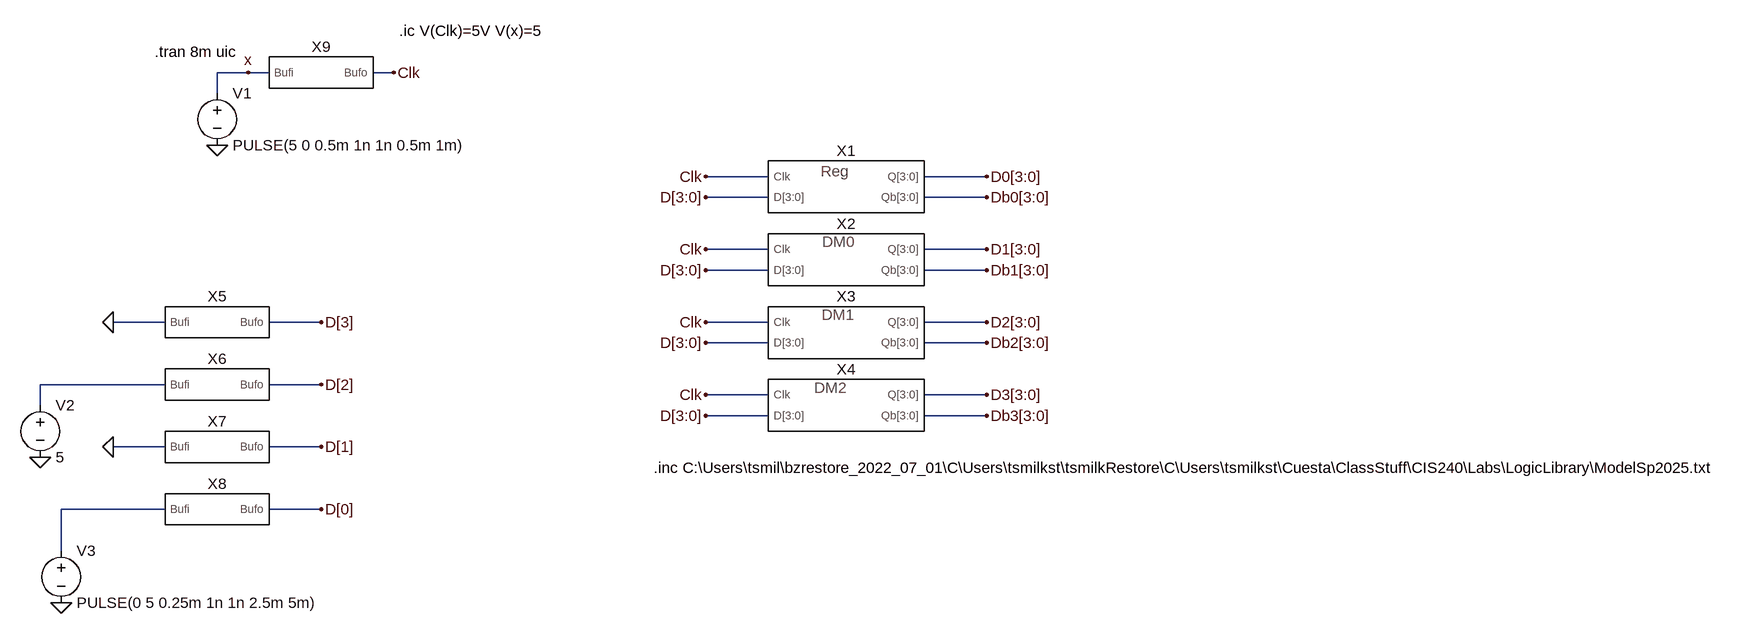
[diagram p0: schematic TestDMz.asc]
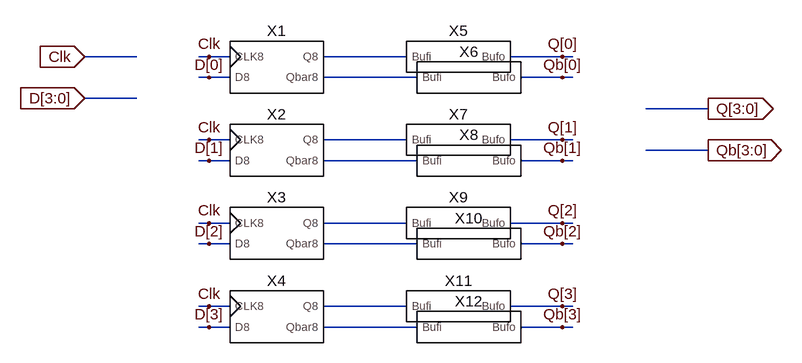
[diagram p1: sub-circuit register.asc]
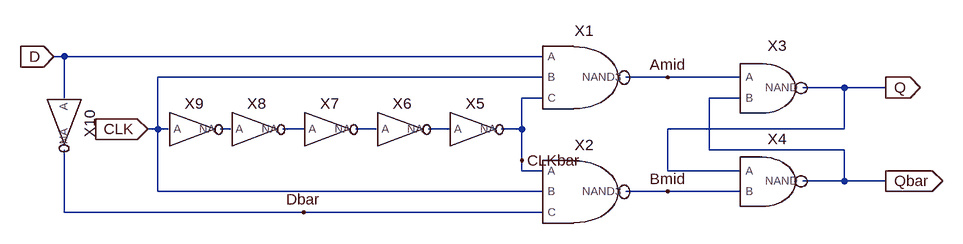
[diagram p2: sub-circuit dff.asc]
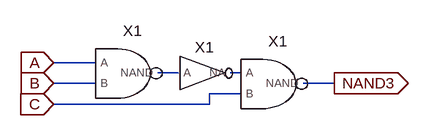
[diagram p3: sub-circuit nand3.asc]
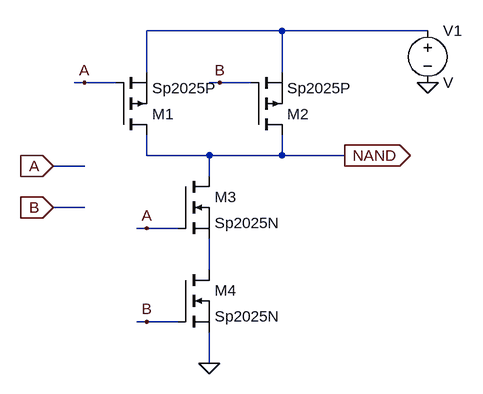
[diagram p4: sub-circuit nand.asc]
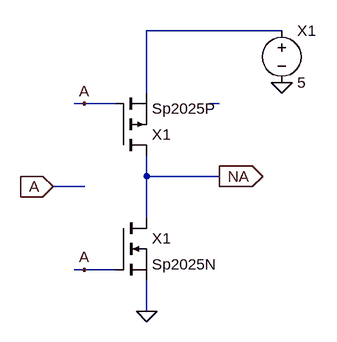
[diagram p5: sub-circuit invert.asc]
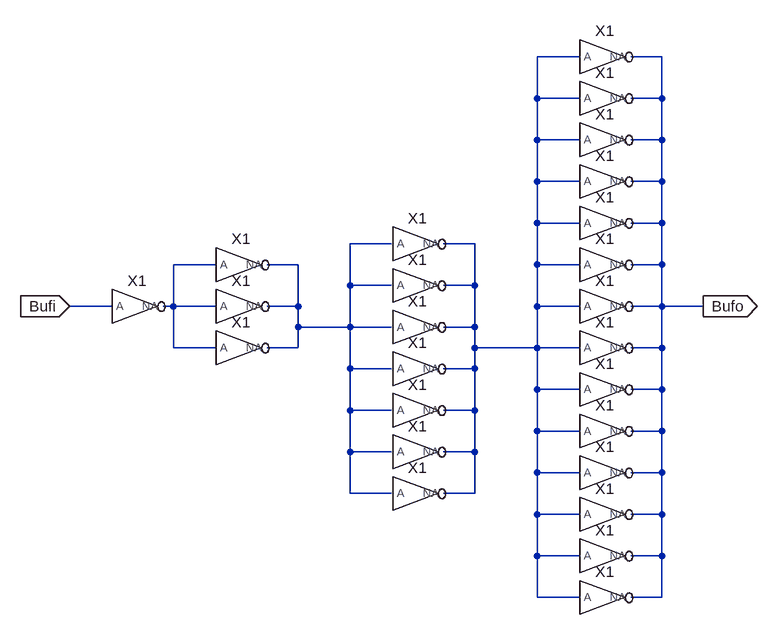
[diagram p6: sub-circuit buffer2x.asc]
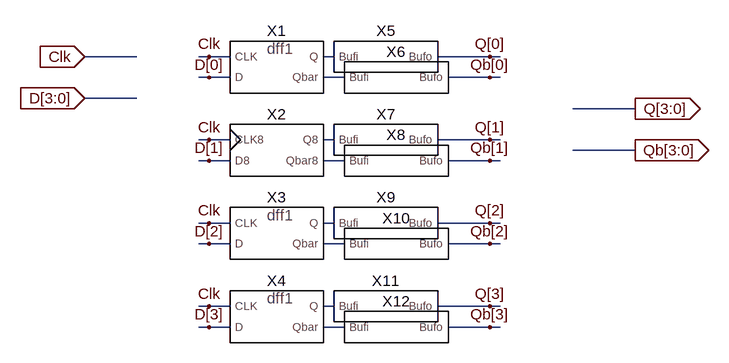
[diagram p7: sub-circuit registerdm0.asc]
TestDMz.asc, the LTspice schematic file:
Version 4.1.1
SHEET 1 1704 740
WIRE -784 -96 -832 -96
WIRE -752 -96 -784 -96
WIRE -560 -96 -592 -96
WIRE -832 -64 -832 -96
WIRE 16 64 -80 64
WIRE 352 64 256 64
WIRE 16 96 -80 96
WIRE 352 96 256 96
WIRE 16 176 -80 176
WIRE 352 176 256 176
WIRE 16 208 -80 208
WIRE 352 208 256 208
WIRE -912 288 -992 288
WIRE -672 288 -752 288
WIRE 16 288 -80 288
WIRE 352 288 256 288
WIRE 16 320 -80 320
WIRE 352 320 256 320
WIRE -912 384 -1104 384
WIRE -672 384 -752 384
WIRE 16 400 -80 400
WIRE 352 400 256 400
WIRE -1104 416 -1104 384
WIRE 16 432 -80 432
WIRE 352 432 256 432
WIRE -912 480 -992 480
WIRE -672 480 -752 480
WIRE -912 576 -1072 576
WIRE -672 576 -752 576
WIRE -1072 640 -1072 576
FLAG -832 16 0
FLAG -560 -96 Clk
FLAG -80 64 Clk
FLAG -80 176 Clk
FLAG -80 288 Clk
FLAG -80 400 Clk
FLAG -992 288 0
FLAG -992 480 0
FLAG -1104 496 0
FLAG -80 96 D[3:0]
FLAG -80 208 D[3:0]
FLAG -80 320 D[3:0]
FLAG -80 432 D[3:0]
FLAG 352 64 D0[3:0]
FLAG 352 96 Db0[3:0]
FLAG 352 176 D1[3:0]
FLAG 352 208 Db1[3:0]
FLAG 352 288 D2[3:0]
FLAG 352 320 Db2[3:0]
FLAG 352 400 D3[3:0]
FLAG 352 432 Db3[3:0]
FLAG -672 288 D[3]
FLAG -672 384 D[2]
FLAG -672 480 D[1]
FLAG -672 576 D[0]
FLAG -1072 720 0
FLAG -784 -96 x
SYMBOL Register 128 80 R0
SYMATTR InstName X1
SYMBOL RegisterDM0 128 192 R0
SYMATTR InstName X2
SYMBOL RegisterDM1 128 304 R0
SYMATTR InstName X3
SYMBOL RegisterDM2 128 416 R0
SYMATTR InstName X4
SYMBOL voltage -832 -80 R0
WINDOW 123 0 0 Left 0
WINDOW 39 0 0 Left 0
SYMATTR InstName V1
SYMATTR Value PULSE(5 0 0.5m 1n 1n 0.5m 1m)
SYMBOL voltage -1104 400 R0
SYMATTR InstName V2
SYMATTR Value 5
SYMBOL Buffer2x -832 288 R0
SYMATTR InstName X5
SYMBOL Buffer2x -832 384 R0
SYMATTR InstName X6
SYMBOL Buffer2x -832 480 R0
SYMATTR InstName X7
SYMBOL Buffer2x -832 576 R0
SYMATTR InstName X8
SYMBOL Buffer2x -672 -96 R0
SYMATTR InstName X9
SYMBOL voltage -1072 624 R0
WINDOW 123 0 0 Left 0
WINDOW 39 0 0 Left 0
SYMATTR InstName V3
SYMATTR Value PULSE(0 5 0.25m 1n 1n 2.5m 5m)
TEXT -928 -128 Left 2 !.tran 8m uic
TEXT -160 512 Left 2 !.inc C:\\Users\\tsmil\\bzrestore_2022_07_01\\C\\Users\\tsmilkst\\tsmilkRestore\\C\\Users\\tsmilkst\\Cuesta\\ClassStuff\\CIS240\\Labs\\LogicLibrary\\ModelSp2025.txt
TEXT -552 -160 Left 2 !.ic V(Clk)=5V V(x)=5

register.asc, the sub-circuit schematic file:
Version 4
SHEET 1 880 680
WIRE -48 96 -128 96
WIRE 64 96 48 96
WIRE 96 96 64 96
WIRE 368 96 240 96
WIRE 608 96 528 96
WIRE 624 96 608 96
WIRE 64 128 48 128
WIRE 96 128 64 128
WIRE 384 128 240 128
WIRE 608 128 544 128
WIRE 624 128 608 128
WIRE -48 160 -128 160
WIRE 832 176 736 176
WIRE 64 224 48 224
WIRE 96 224 64 224
WIRE 368 224 240 224
WIRE 608 224 528 224
WIRE 624 224 608 224
WIRE 832 240 736 240
WIRE 64 256 48 256
WIRE 96 256 64 256
WIRE 384 256 240 256
WIRE 608 256 544 256
WIRE 624 256 608 256
WIRE 64 352 48 352
WIRE 96 352 64 352
WIRE 368 352 240 352
WIRE 608 352 528 352
WIRE 624 352 608 352
WIRE 64 384 48 384
WIRE 96 384 64 384
WIRE 384 384 240 384
WIRE 608 384 544 384
WIRE 624 384 608 384
WIRE 64 480 48 480
WIRE 96 480 64 480
WIRE 368 480 240 480
WIRE 608 480 528 480
WIRE 624 480 608 480
WIRE 64 512 48 512
WIRE 96 512 64 512
WIRE 384 512 240 512
WIRE 608 512 544 512
WIRE 624 512 608 512
FLAG 64 96 Clk
FLAG 64 128 D[0]
FLAG 608 96 Q[0]
FLAG 608 128 Qb[0]
FLAG 64 224 Clk
FLAG 64 256 D[1]
FLAG 608 224 Q[1]
FLAG 608 256 Qb[1]
FLAG 64 352 Clk
FLAG 64 384 D[2]
FLAG 608 352 Q[2]
FLAG 608 384 Qb[2]
FLAG 64 480 Clk
FLAG 64 512 D[3]
FLAG 608 480 Q[3]
FLAG 608 512 Qb[3]
FLAG -128 96 Clk
IOPIN -128 96 In
FLAG -128 160 D[3:0]
IOPIN -128 160 In
FLAG 832 176 Q[3:0]
IOPIN 832 176 Out
FLAG 832 240 Qb[3:0]
IOPIN 832 240 Out
SYMBOL dff 160 112 R0
SYMATTR InstName X1
SYMBOL dff 160 240 R0
SYMATTR InstName X2
SYMBOL dff 160 368 R0
SYMATTR InstName X3
SYMBOL dff 160 496 R0
SYMATTR InstName X4
SYMBOL Buffer2x 448 96 R0
SYMATTR InstName X5
SYMBOL Buffer2x 464 128 R0
SYMATTR InstName X6
SYMBOL Buffer2x 448 224 R0
SYMATTR InstName X7
SYMBOL Buffer2x 464 256 R0
SYMATTR InstName X8
SYMBOL Buffer2x 448 352 R0
SYMATTR InstName X9
SYMBOL Buffer2x 464 384 R0
SYMATTR InstName X10
SYMBOL Buffer2x 448 480 R0
SYMATTR InstName X11
SYMBOL Buffer2x 464 512 R0
SYMATTR InstName X12

dff.asc, the sub-circuit schematic file:
Version 4.1
SHEET 1 880 680
WIRE -592 64 -608 64
WIRE 144 64 -592 64
WIRE 144 96 -448 96
WIRE 336 96 272 96
WIRE 448 96 336 96
WIRE 608 112 544 112
WIRE 672 112 608 112
WIRE -592 128 -592 64
WIRE 144 128 112 128
WIRE 448 128 400 128
WIRE -448 176 -448 96
WIRE -448 176 -464 176
WIRE -432 176 -448 176
WIRE -336 176 -352 176
WIRE -224 176 -256 176
WIRE -112 176 -144 176
WIRE 0 176 -32 176
WIRE 112 176 112 128
WIRE 112 176 80 176
WIRE 608 176 608 112
WIRE 608 176 336 176
WIRE 400 208 400 128
WIRE 608 208 400 208
WIRE 112 224 112 176
WIRE 112 240 112 224
WIRE 144 240 112 240
WIRE 336 240 336 176
WIRE 448 240 336 240
WIRE 608 256 608 208
WIRE 608 256 544 256
WIRE 672 256 608 256
WIRE -448 272 -448 176
WIRE 144 272 -448 272
WIRE 336 272 272 272
WIRE 448 272 336 272
WIRE -592 304 -592 208
WIRE -224 304 -592 304
WIRE 144 304 -224 304
FLAG -608 64 D
IOPIN -608 64 In
FLAG -464 176 CLK
IOPIN -464 176 In
FLAG 672 112 Q
IOPIN 672 112 Out
FLAG 672 256 Qbar
IOPIN 672 256 Out
FLAG -224 304 Dbar
FLAG 336 96 Amid
FLAG 336 272 Bmid
FLAG 112 224 CLKbar
SYMBOL NAND3 208 96 R0
SYMATTR InstName X1
SYMBOL NAND3 208 272 R0
SYMATTR InstName X2
SYMBOL INVERT 32 176 R0
SYMATTR InstName X5
SYMBOL INVERT -80 176 R0
SYMATTR InstName X6
SYMBOL INVERT -192 176 R0
SYMATTR InstName X7
SYMBOL INVERT -304 176 R0
SYMATTR InstName X8
SYMBOL INVERT -400 176 R0
SYMATTR InstName X9
SYMBOL NAND 496 112 R0
SYMATTR InstName X3
SYMBOL NAND 496 256 R0
SYMATTR InstName X4
SYMBOL INVERT -592 160 R90
SYMATTR InstName X10

nand3.asc, the sub-circuit schematic file:
Version 4
SHEET 1 880 680
WIRE 80 80 16 80
WIRE 208 96 176 96
WIRE 304 96 288 96
WIRE 80 112 16 112
WIRE 448 112 400 112
WIRE 304 128 256 128
WIRE 256 144 256 128
WIRE 256 144 16 144
FLAG 16 80 A
IOPIN 16 80 In
FLAG 16 112 B
IOPIN 16 112 In
FLAG 16 144 C
IOPIN 16 144 In
FLAG 448 112 NAND3
IOPIN 448 112 Out
SYMBOL NAND 128 96 R0
SYMATTR InstName X1
SYMBOL NAND 352 112 R0
SYMATTR InstName X1
SYMBOL INVERT 240 96 R0
SYMATTR InstName X1

nand.asc, the sub-circuit schematic file:
Version 4
SHEET 1 880 680
.lib SHEET 1 880 680
WIRE 336 -160 128 -160
WIRE 560 -160 336 -160
WIRE 128 -96 128 -160
WIRE 336 -96 336 -160
WIRE 32 -80 16 -80
WIRE 80 -80 32 -80
WIRE 240 -80 224 -80
WIRE 288 -80 240 -80
WIRE 128 32 128 0
WIRE 224 32 128 32
WIRE 336 32 336 0
WIRE 336 32 224 32
WIRE 432 32 336 32
WIRE 32 48 -16 48
WIRE 224 64 224 32
WIRE 32 112 -16 112
WIRE 128 144 112 144
WIRE 176 144 128 144
WIRE 224 208 224 160
WIRE 128 288 112 288
WIRE 176 288 128 288
WIRE 224 352 224 304
FLAG 224 352 0
FLAG -16 48 A
IOPIN -16 48 In
FLAG -16 112 B
IOPIN -16 112 In
FLAG 128 144 A
FLAG 128 288 B
FLAG 32 -80 A
FLAG 240 -80 B
FLAG 432 32 NAND
IOPIN 432 32 Out
FLAG 560 -80 0
SYMBOL pmos 80 0 M180
SYMATTR InstName M1
SYMATTR Value Sp2025P
SYMBOL pmos 288 0 M180
SYMATTR InstName M2
SYMATTR Value Sp2025P
SYMBOL nmos 176 64 R0
SYMATTR InstName M3
SYMATTR Value Sp2025N
SYMBOL nmos 176 208 R0
SYMATTR InstName M4
SYMATTR Value Sp2025N
SYMBOL voltage 560 -176 R0
SYMATTR InstName V1

invert.asc, the sub-circuit schematic file:
Version 4
SHEET 1 880 680
WIRE 352 -80 144 -80
WIRE 144 16 144 -80
WIRE 48 32 32 32
WIRE 96 32 48 32
WIRE 256 32 240 32
WIRE 144 144 144 112
WIRE 256 144 144 144
WIRE 48 160 0 160
WIRE 144 208 144 144
WIRE 48 288 32 288
WIRE 96 288 48 288
WIRE 144 352 144 304
FLAG 144 352 0
FLAG 0 160 A
IOPIN 0 160 In
FLAG 48 288 A
FLAG 48 32 A
FLAG 256 144 NA
IOPIN 256 144 Out
FLAG 352 0 0
SYMBOL pmos 96 112 M180
SYMATTR InstName X1
SYMATTR Value Sp2025P
SYMBOL nmos 96 208 R0
SYMATTR InstName X1
SYMATTR Value Sp2025N
SYMBOL voltage 352 -96 R0
SYMATTR InstName X1
SYMATTR Value 5

buffer2x.asc, the sub-circuit schematic file:
Version 4
SHEET 1 880 680
WIRE 784 -256 720 -256
WIRE 912 -256 864 -256
WIRE 720 -192 720 -256
WIRE 784 -192 720 -192
WIRE 912 -192 912 -256
WIRE 912 -192 864 -192
WIRE 720 -128 720 -192
WIRE 784 -128 720 -128
WIRE 912 -128 912 -192
WIRE 912 -128 864 -128
WIRE 720 -64 720 -128
WIRE 784 -64 720 -64
WIRE 912 -64 912 -128
WIRE 912 -64 864 -64
WIRE 720 0 720 -64
WIRE 784 0 720 0
WIRE 912 0 912 -64
WIRE 912 0 864 0
WIRE 496 32 432 32
WIRE 624 32 576 32
WIRE 224 64 160 64
WIRE 352 64 304 64
WIRE 720 64 720 0
WIRE 784 64 720 64
WIRE 912 64 912 0
WIRE 912 64 864 64
WIRE 432 96 432 32
WIRE 496 96 432 96
WIRE 624 96 624 32
WIRE 624 96 576 96
WIRE 64 128 0 128
WIRE 160 128 160 64
WIRE 160 128 144 128
WIRE 224 128 160 128
WIRE 352 128 352 64
WIRE 352 128 304 128
WIRE 720 128 720 64
WIRE 784 128 720 128
WIRE 912 128 912 64
WIRE 912 128 864 128
WIRE 976 128 912 128
WIRE 352 160 352 128
WIRE 432 160 432 96
WIRE 432 160 352 160
WIRE 496 160 432 160
WIRE 624 160 624 96
WIRE 624 160 576 160
WIRE 160 192 160 128
WIRE 224 192 160 192
WIRE 352 192 352 160
WIRE 352 192 304 192
WIRE 624 192 624 160
WIRE 720 192 720 128
WIRE 720 192 624 192
WIRE 784 192 720 192
WIRE 912 192 912 128
WIRE 912 192 864 192
WIRE 432 224 432 160
WIRE 496 224 432 224
WIRE 624 224 624 192
WIRE 624 224 576 224
WIRE 720 256 720 192
WIRE 784 256 720 256
WIRE 912 256 912 192
WIRE 912 256 864 256
WIRE 432 288 432 224
WIRE 496 288 432 288
WIRE 624 288 624 224
WIRE 624 288 576 288
WIRE 720 320 720 256
WIRE 784 320 720 320
WIRE 912 320 912 256
WIRE 912 320 864 320
WIRE 432 352 432 288
WIRE 496 352 432 352
WIRE 624 352 624 288
WIRE 624 352 576 352
WIRE 720 384 720 320
WIRE 784 384 720 384
WIRE 912 384 912 320
WIRE 912 384 864 384
WIRE 432 416 432 352
WIRE 496 416 432 416
WIRE 624 416 624 352
WIRE 624 416 576 416
WIRE 720 448 720 384
WIRE 784 448 720 448
WIRE 912 448 912 384
WIRE 912 448 864 448
WIRE 720 512 720 448
WIRE 784 512 720 512
WIRE 912 512 912 448
WIRE 912 512 864 512
WIRE 720 576 720 512
WIRE 784 576 720 576
WIRE 912 576 912 512
WIRE 912 576 864 576
FLAG 0 128 Bufi
IOPIN 0 128 In
FLAG 976 128 Bufo
IOPIN 976 128 Out
SYMBOL INVERT 96 128 R0
SYMATTR InstName X1
SYMBOL INVERT 256 64 R0
SYMATTR InstName X1
SYMBOL INVERT 256 128 R0
SYMATTR InstName X1
SYMBOL INVERT 256 192 R0
SYMATTR InstName X1
SYMBOL INVERT 528 32 R0
SYMATTR InstName X1
SYMBOL INVERT 528 96 R0
SYMATTR InstName X1
SYMBOL INVERT 528 160 R0
SYMATTR InstName X1
SYMBOL INVERT 528 224 R0
SYMATTR InstName X1
SYMBOL INVERT 528 288 R0
SYMATTR InstName X1
SYMBOL INVERT 528 352 R0
SYMATTR InstName X1
SYMBOL INVERT 528 416 R0
SYMATTR InstName X1
SYMBOL INVERT 816 -256 R0
SYMATTR InstName X1
SYMBOL INVERT 816 -192 R0
SYMATTR InstName X1
SYMBOL INVERT 816 -128 R0
SYMATTR InstName X1
SYMBOL INVERT 816 -64 R0
SYMATTR InstName X1
SYMBOL INVERT 816 0 R0
SYMATTR InstName X1
SYMBOL INVERT 816 64 R0
SYMATTR InstName X1
SYMBOL INVERT 816 128 R0
SYMATTR InstName X1
SYMBOL INVERT 816 192 R0
SYMATTR InstName X1
SYMBOL INVERT 816 256 R0
SYMATTR InstName X1
SYMBOL INVERT 816 320 R0
SYMATTR InstName X1
SYMBOL INVERT 816 384 R0
SYMATTR InstName X1
SYMBOL INVERT 816 448 R0
SYMATTR InstName X1
SYMBOL INVERT 816 512 R0
SYMATTR InstName X1
SYMBOL INVERT 816 576 R0
SYMATTR InstName X1

registerdm0.asc, the sub-circuit schematic file:
Version 4
SHEET 1 880 680
WIRE -48 96 -128 96
WIRE 64 96 48 96
WIRE 96 96 64 96
WIRE 256 96 240 96
WIRE 496 96 416 96
WIRE 512 96 496 96
WIRE 64 128 48 128
WIRE 96 128 64 128
WIRE 272 128 240 128
WIRE 496 128 432 128
WIRE 512 128 496 128
WIRE -48 160 -128 160
WIRE 720 176 624 176
WIRE 64 224 48 224
WIRE 96 224 64 224
WIRE 256 224 240 224
WIRE 496 224 416 224
WIRE 512 224 496 224
WIRE 720 240 624 240
WIRE 64 256 48 256
WIRE 96 256 64 256
WIRE 272 256 240 256
WIRE 496 256 432 256
WIRE 512 256 496 256
WIRE 64 352 48 352
WIRE 96 352 64 352
WIRE 256 352 240 352
WIRE 496 352 416 352
WIRE 512 352 496 352
WIRE 64 384 48 384
WIRE 96 384 64 384
WIRE 272 384 240 384
WIRE 496 384 432 384
WIRE 512 384 496 384
WIRE 64 480 48 480
WIRE 96 480 64 480
WIRE 256 480 240 480
WIRE 496 480 416 480
WIRE 512 480 496 480
WIRE 64 512 48 512
WIRE 96 512 64 512
WIRE 272 512 240 512
WIRE 496 512 432 512
WIRE 512 512 496 512
FLAG 64 96 Clk
FLAG 64 128 D[0]
FLAG 496 96 Q[0]
FLAG 496 128 Qb[0]
FLAG 64 224 Clk
FLAG 64 256 D[1]
FLAG 496 224 Q[1]
FLAG 496 256 Qb[1]
FLAG 64 352 Clk
FLAG 64 384 D[2]
FLAG 496 352 Q[2]
FLAG 496 384 Qb[2]
FLAG 64 480 Clk
FLAG 64 512 D[3]
FLAG 496 480 Q[3]
FLAG 496 512 Qb[3]
FLAG -128 96 Clk
IOPIN -128 96 In
FLAG -128 160 D[3:0]
IOPIN -128 160 In
FLAG 720 176 Q[3:0]
IOPIN 720 176 Out
FLAG 720 240 Qb[3:0]
IOPIN 720 240 Out
SYMBOL dff 160 240 R0
SYMATTR InstName X2
SYMBOL dff1 160 112 R0
SYMATTR InstName X1
SYMBOL dff1 160 368 R0
SYMATTR InstName X3
SYMBOL dff1 160 496 R0
SYMATTR InstName X4
SYMBOL Buffer2x 336 96 R0
SYMATTR InstName X5
SYMBOL Buffer2x 352 128 R0
SYMATTR InstName X6
SYMBOL Buffer2x 336 224 R0
SYMATTR InstName X7
SYMBOL Buffer2x 352 256 R0
SYMATTR InstName X8
SYMBOL Buffer2x 336 352 R0
SYMATTR InstName X9
SYMBOL Buffer2x 352 384 R0
SYMATTR InstName X10
SYMBOL Buffer2x 336 480 R0
SYMATTR InstName X11
SYMBOL Buffer2x 352 512 R0
SYMATTR InstName X12

dff1.asc, the sub-circuit schematic file:
Version 4
SHEET 1 880 680
WIRE -592 64 -608 64
WIRE 144 64 -592 64
WIRE 144 96 -448 96
WIRE 336 96 272 96
WIRE 448 96 336 96
WIRE 608 112 544 112
WIRE 672 112 608 112
WIRE -592 128 -592 64
WIRE 144 128 112 128
WIRE 448 128 400 128
WIRE -448 176 -448 96
WIRE -448 176 -464 176
WIRE -432 176 -448 176
WIRE -336 176 -352 176
WIRE -224 176 -256 176
WIRE -112 176 -144 176
WIRE 0 176 -32 176
WIRE 112 176 112 128
WIRE 112 176 80 176
WIRE 608 176 608 112
WIRE 608 176 336 176
WIRE 400 208 400 128
WIRE 608 208 400 208
WIRE 112 224 112 176
WIRE 112 240 112 224
WIRE 144 240 112 240
WIRE 336 240 336 176
WIRE 448 240 336 240
WIRE 608 256 608 208
WIRE 608 256 544 256
WIRE 672 256 608 256
WIRE -448 272 -448 176
WIRE 144 272 -448 272
WIRE 336 272 272 272
WIRE 448 272 336 272
WIRE -592 304 -592 208
WIRE -224 304 -592 304
WIRE 144 304 -224 304
FLAG -608 64 D
IOPIN -608 64 In
FLAG -464 176 CLK
IOPIN -464 176 In
FLAG 672 112 Q
IOPIN 672 112 Out
FLAG 672 256 Qbar
IOPIN 672 256 Out
FLAG -224 304 Dbar
FLAG 336 96 Amid
FLAG 336 272 Bmid
FLAG 112 224 CLKbar
SYMBOL NAND3 208 96 R0
SYMATTR InstName X1
SYMBOL NAND3 208 272 R0
SYMATTR InstName X1
SYMBOL INVERT 32 176 R0
SYMATTR InstName X1
SYMBOL INVERT -80 176 R0
SYMATTR InstName X1
SYMBOL INVERT -192 176 R0
SYMATTR InstName X1
SYMBOL INVERT -304 176 R0
SYMATTR InstName X1
SYMBOL INVERT -400 176 R0
SYMATTR InstName X1
SYMBOL NAND 496 112 R0
SYMATTR InstName X1
SYMBOL NAND 496 256 R0
SYMATTR InstName X1
SYMBOL INVERT -592 160 R90
SYMATTR InstName X1
TEXT -144 -112 Left 2 !.ic V(Amid)=5\n.ic V(Bmid)=5\n.ic V(Q)=5\n.ic V(Qbar)=0\n.ic V(CLKbar)=5\n.ic V(CLK)=0

registerdm1.asc, the sub-circuit schematic file:
Version 4
SHEET 1 880 680
WIRE -48 96 -128 96
WIRE 64 96 48 96
WIRE 96 96 64 96
WIRE 256 96 240 96
WIRE 496 96 416 96
WIRE 512 96 496 96
WIRE 64 128 48 128
WIRE 96 128 64 128
WIRE 272 128 240 128
WIRE 496 128 432 128
WIRE 512 128 496 128
WIRE -48 160 -128 160
WIRE 720 176 624 176
WIRE 64 224 48 224
WIRE 96 224 64 224
WIRE 256 224 240 224
WIRE 496 224 416 224
WIRE 512 224 496 224
WIRE 720 240 624 240
WIRE 64 256 48 256
WIRE 96 256 64 256
WIRE 272 256 240 256
WIRE 496 256 432 256
WIRE 512 256 496 256
WIRE 64 352 48 352
WIRE 96 352 64 352
WIRE 256 352 240 352
WIRE 496 352 416 352
WIRE 512 352 496 352
WIRE 64 384 48 384
WIRE 96 384 64 384
WIRE 272 384 240 384
WIRE 496 384 432 384
WIRE 512 384 496 384
WIRE 64 480 48 480
WIRE 96 480 64 480
WIRE 256 480 240 480
WIRE 496 480 416 480
WIRE 512 480 496 480
WIRE 64 512 48 512
WIRE 96 512 64 512
WIRE 272 512 240 512
WIRE 496 512 432 512
WIRE 512 512 496 512
FLAG 64 96 Clk
FLAG 64 128 D[0]
FLAG 496 96 Q[0]
FLAG 496 128 Qb[0]
FLAG 64 224 Clk
FLAG 64 256 D[1]
FLAG 496 224 Q[1]
FLAG 496 256 Qb[1]
FLAG 64 352 Clk
FLAG 64 384 D[2]
FLAG 496 352 Q[2]
FLAG 496 384 Qb[2]
FLAG 64 480 Clk
FLAG 64 512 D[3]
FLAG 496 480 Q[3]
FLAG 496 512 Qb[3]
FLAG -128 96 Clk
IOPIN -128 96 In
FLAG -128 160 D[3:0]
IOPIN -128 160 In
FLAG 720 176 Q[3:0]
IOPIN 720 176 Out
FLAG 720 240 Qb[3:0]
IOPIN 720 240 Out
SYMBOL dff 160 240 R0
SYMATTR InstName X2
SYMBOL dff 160 496 R0
SYMATTR InstName X4
SYMBOL dff1 160 112 R0
SYMATTR InstName X1
SYMBOL dff1 160 368 R0
SYMATTR InstName X3
SYMBOL Buffer2x 336 96 R0
SYMATTR InstName X5
SYMBOL Buffer2x 352 128 R0
SYMATTR InstName X6
SYMBOL Buffer2x 336 224 R0
SYMATTR InstName X7
SYMBOL Buffer2x 352 256 R0
SYMATTR InstName X8
SYMBOL Buffer2x 336 352 R0
SYMATTR InstName X9
SYMBOL Buffer2x 352 384 R0
SYMATTR InstName X10
SYMBOL Buffer2x 336 480 R0
SYMATTR InstName X11
SYMBOL Buffer2x 352 512 R0
SYMATTR InstName X12

registerdm2.asc, the sub-circuit schematic file:
Version 4
SHEET 1 880 680
WIRE -48 96 -128 96
WIRE 64 96 48 96
WIRE 96 96 64 96
WIRE 256 96 240 96
WIRE 496 96 416 96
WIRE 512 96 496 96
WIRE 64 128 48 128
WIRE 96 128 64 128
WIRE 272 128 240 128
WIRE 496 128 432 128
WIRE 512 128 496 128
WIRE -48 160 -128 160
WIRE 720 176 624 176
WIRE 64 224 48 224
WIRE 96 224 64 224
WIRE 256 224 240 224
WIRE 496 224 416 224
WIRE 512 224 496 224
WIRE 720 240 624 240
WIRE 64 256 48 256
WIRE 96 256 64 256
WIRE 272 256 240 256
WIRE 496 256 432 256
WIRE 512 256 496 256
WIRE 64 352 48 352
WIRE 96 352 64 352
WIRE 256 352 240 352
WIRE 496 352 416 352
WIRE 512 352 496 352
WIRE 64 384 48 384
WIRE 96 384 64 384
WIRE 272 384 240 384
WIRE 496 384 432 384
WIRE 512 384 496 384
WIRE 64 480 48 480
WIRE 96 480 64 480
WIRE 256 480 240 480
WIRE 496 480 416 480
WIRE 512 480 496 480
WIRE 64 512 48 512
WIRE 96 512 64 512
WIRE 272 512 240 512
WIRE 496 512 432 512
WIRE 512 512 496 512
FLAG 64 96 Clk
FLAG 64 128 D[0]
FLAG 496 96 Q[0]
FLAG 496 128 Qb[0]
FLAG 64 224 Clk
FLAG 64 256 D[1]
FLAG 496 224 Q[1]
FLAG 496 256 Qb[1]
FLAG 64 352 Clk
FLAG 64 384 D[2]
FLAG 496 352 Q[2]
FLAG 496 384 Qb[2]
FLAG 64 480 Clk
FLAG 64 512 D[3]
FLAG 496 480 Q[3]
FLAG 496 512 Qb[3]
FLAG -128 96 Clk
IOPIN -128 96 In
FLAG -128 160 D[3:0]
IOPIN -128 160 In
FLAG 720 176 Q[3:0]
IOPIN 720 176 Out
FLAG 720 240 Qb[3:0]
IOPIN 720 240 Out
SYMBOL dff 160 240 R0
SYMATTR InstName X2
SYMBOL dff 160 368 R0
SYMATTR InstName X3
SYMBOL dff 160 496 R0
SYMATTR InstName X4
SYMBOL dff1 160 112 R0
SYMATTR InstName X1
SYMBOL Buffer2x 336 96 R0
SYMATTR InstName X5
SYMBOL Buffer2x 352 128 R0
SYMATTR InstName X6
SYMBOL Buffer2x 336 224 R0
SYMATTR InstName X7
SYMBOL Buffer2x 352 256 R0
SYMATTR InstName X8
SYMBOL Buffer2x 336 352 R0
SYMATTR InstName X9
SYMBOL Buffer2x 352 384 R0
SYMATTR InstName X10
SYMBOL Buffer2x 336 480 R0
SYMATTR InstName X11
SYMBOL Buffer2x 352 512 R0
SYMATTR InstName X12

The netlist it stands for:
* TestDMz.asc
XX1 Clk D[3] D[2] D[1] D[0] D0[3] D0[2] D0[1] D0[0] Db0[3] Db0[2] Db0[1] Db0[0] register
XX2 Clk D[3] D[2] D[1] D[0] D1[3] D1[2] D1[1] D1[0] Db1[3] Db1[2] Db1[1] Db1[0] registerdm0
XX3 Clk D[3] D[2] D[1] D[0] D2[3] D2[2] D2[1] D2[0] Db2[3] Db2[2] Db2[1] Db2[0] registerdm1
XX4 Clk D[3] D[2] D[1] D[0] D3[3] D3[2] D3[1] D3[0] Db3[3] Db3[2] Db3[1] Db3[0] registerdm2
V1 x 0 PULSE(5 0 0.5m 1n 1n 0.5m 1m)
V2 N001 0 5
XX5 0 D[3] buffer2x
XX6 N001 D[2] buffer2x
XX7 0 D[1] buffer2x
XX8 N002 D[0] buffer2x
XX9 x Clk buffer2x
V3 N002 0 PULSE(0 5 0.25m 1n 1n 2.5m 5m)

* block symbol definitions
.subckt register Clk D[3] D[2] D[1] D[0] Q[3] Q[2] Q[1] Q[0] Qb[3] Qb[2] Qb[1] Qb[0]
XX1 Clk D[0] N001 N002 dff
XX2 Clk D[1] N003 N004 dff
XX3 Clk D[2] N005 N006 dff
XX4 Clk D[3] N007 N008 dff
XX5 N001 Q[0] buffer2x
XX6 N002 Qb[0] buffer2x
XX7 N003 Q[1] buffer2x
XX8 N004 Qb[1] buffer2x
XX9 N005 Q[2] buffer2x
XX10 N006 Qb[2] buffer2x
XX11 N007 Q[3] buffer2x
XX12 N008 Qb[3] buffer2x
.ends register

.subckt dff CLK8 D8 Q8 Qbar8
X§X1 D CLK CLKbar Amid nand3
X§X2 CLKbar CLK Dbar Bmid nand3
X§X5 N004 CLKbar invert
X§X6 N003 N004 invert
X§X7 N002 N003 invert
X§X8 N001 N002 invert
X§X9 CLK N001 invert
X§X3 Amid Qbar Q nand
X§X4 Q Bmid Qbar nand
X§X10 D Dbar invert
.ends dff

.subckt nand3 A B C NAND3
XX1 A B N001 nand
XX1 N002 C NAND3 nand
XX1 N001 N002 invert
.ends nand3

.subckt nand A B NAND
M1 NAND A N001 N001 Sp2025P
M2 NAND B N001 N001 Sp2025P
M3 NAND A N002 N002 Sp2025N
M4 N002 B 0 0 Sp2025N
V1 N001 0 V
.ends nand

.subckt invert A NA
M§X1 NA A N001 N001 Sp2025P
M§X1 NA A 0 0 Sp2025N
V§X1 N001 0 5
.ends invert

.subckt buffer2x Bufi Bufo
XX1 Bufi N003 invert
XX1 N003 N002 invert
XX1 N003 N002 invert
XX1 N003 N002 invert
XX1 N002 N001 invert
XX1 N002 N001 invert
XX1 N002 N001 invert
XX1 N002 N001 invert
XX1 N002 N001 invert
XX1 N002 N001 invert
XX1 N002 N001 invert
XX1 N001 Bufo invert
XX1 N001 Bufo invert
XX1 N001 Bufo invert
XX1 N001 Bufo invert
XX1 N001 Bufo invert
XX1 N001 Bufo invert
XX1 N001 Bufo invert
XX1 N001 Bufo invert
XX1 N001 Bufo invert
XX1 N001 Bufo invert
XX1 N001 Bufo invert
XX1 N001 Bufo invert
XX1 N001 Bufo invert
XX1 N001 Bufo invert
.ends buffer2x

.subckt registerdm0 Clk D[3] D[2] D[1] D[0] Q[3] Q[2] Q[1] Q[0] Qb[3] Qb[2] Qb[1] Qb[0]
XX2 Clk D[1] N003 N004 dff
XX1 Clk D[0] N001 N002 dff1
XX3 Clk D[2] N005 N006 dff1
XX4 Clk D[3] N007 N008 dff1
XX5 N001 Q[0] buffer2x
XX6 N002 Qb[0] buffer2x
XX7 N003 Q[1] buffer2x
XX8 N004 Qb[1] buffer2x
XX9 N005 Q[2] buffer2x
XX10 N006 Qb[2] buffer2x
XX11 N007 Q[3] buffer2x
XX12 N008 Qb[3] buffer2x
.ends registerdm0

.subckt dff1 CLK D Q Qbar
XX1 D CLK CLKbar Amid nand3
XX1 CLKbar CLK Dbar Bmid nand3
XX1 N004 CLKbar invert
XX1 N003 N004 invert
XX1 N002 N003 invert
XX1 N001 N002 invert
XX1 CLK N001 invert
XX1 Amid Qbar Q nand
XX1 Q Bmid Qbar nand
XX1 D Dbar invert
.ic V(Amid)=5
.ic V(Bmid)=5
.ic V(Q)=5
.ic V(Qbar)=0
.ic V(CLKbar)=5
.ic V(CLK)=0
.ends dff1

.subckt registerdm1 Clk D[3] D[2] D[1] D[0] Q[3] Q[2] Q[1] Q[0] Qb[3] Qb[2] Qb[1] Qb[0]
XX2 Clk D[1] N003 N004 dff
XX4 Clk D[3] N007 N008 dff
XX1 Clk D[0] N001 N002 dff1
XX3 Clk D[2] N005 N006 dff1
XX5 N001 Q[0] buffer2x
XX6 N002 Qb[0] buffer2x
XX7 N003 Q[1] buffer2x
XX8 N004 Qb[1] buffer2x
XX9 N005 Q[2] buffer2x
XX10 N006 Qb[2] buffer2x
XX11 N007 Q[3] buffer2x
XX12 N008 Qb[3] buffer2x
.ends registerdm1

.subckt registerdm2 Clk D[3] D[2] D[1] D[0] Q[3] Q[2] Q[1] Q[0] Qb[3] Qb[2] Qb[1] Qb[0]
XX2 Clk D[1] N003 N004 dff
XX3 Clk D[2] N005 N006 dff
XX4 Clk D[3] N007 N008 dff
XX1 Clk D[0] N001 N002 dff1
XX5 N001 Q[0] buffer2x
XX6 N002 Qb[0] buffer2x
XX7 N003 Q[1] buffer2x
XX8 N004 Qb[1] buffer2x
XX9 N005 Q[2] buffer2x
XX10 N006 Qb[2] buffer2x
XX11 N007 Q[3] buffer2x
XX12 N008 Qb[3] buffer2x
.ends registerdm2

.model NMOS NMOS
.model PMOS PMOS
.lib standard.mos
.tran 8m uic
.inc C:\Users\tsmil\bzrestore_2022_07_01\C\Users\tsmilkst\tsmilkRestore\C\Users\tsmilkst\Cuesta\ClassStuff\CIS240\Labs\LogicLibrary\ModelSp2025.txt
.ic V(Clk)=5V V(x)=5
.backanno
.end